# EAGLE design macropad_v1 (EAGLE 9.2.1)
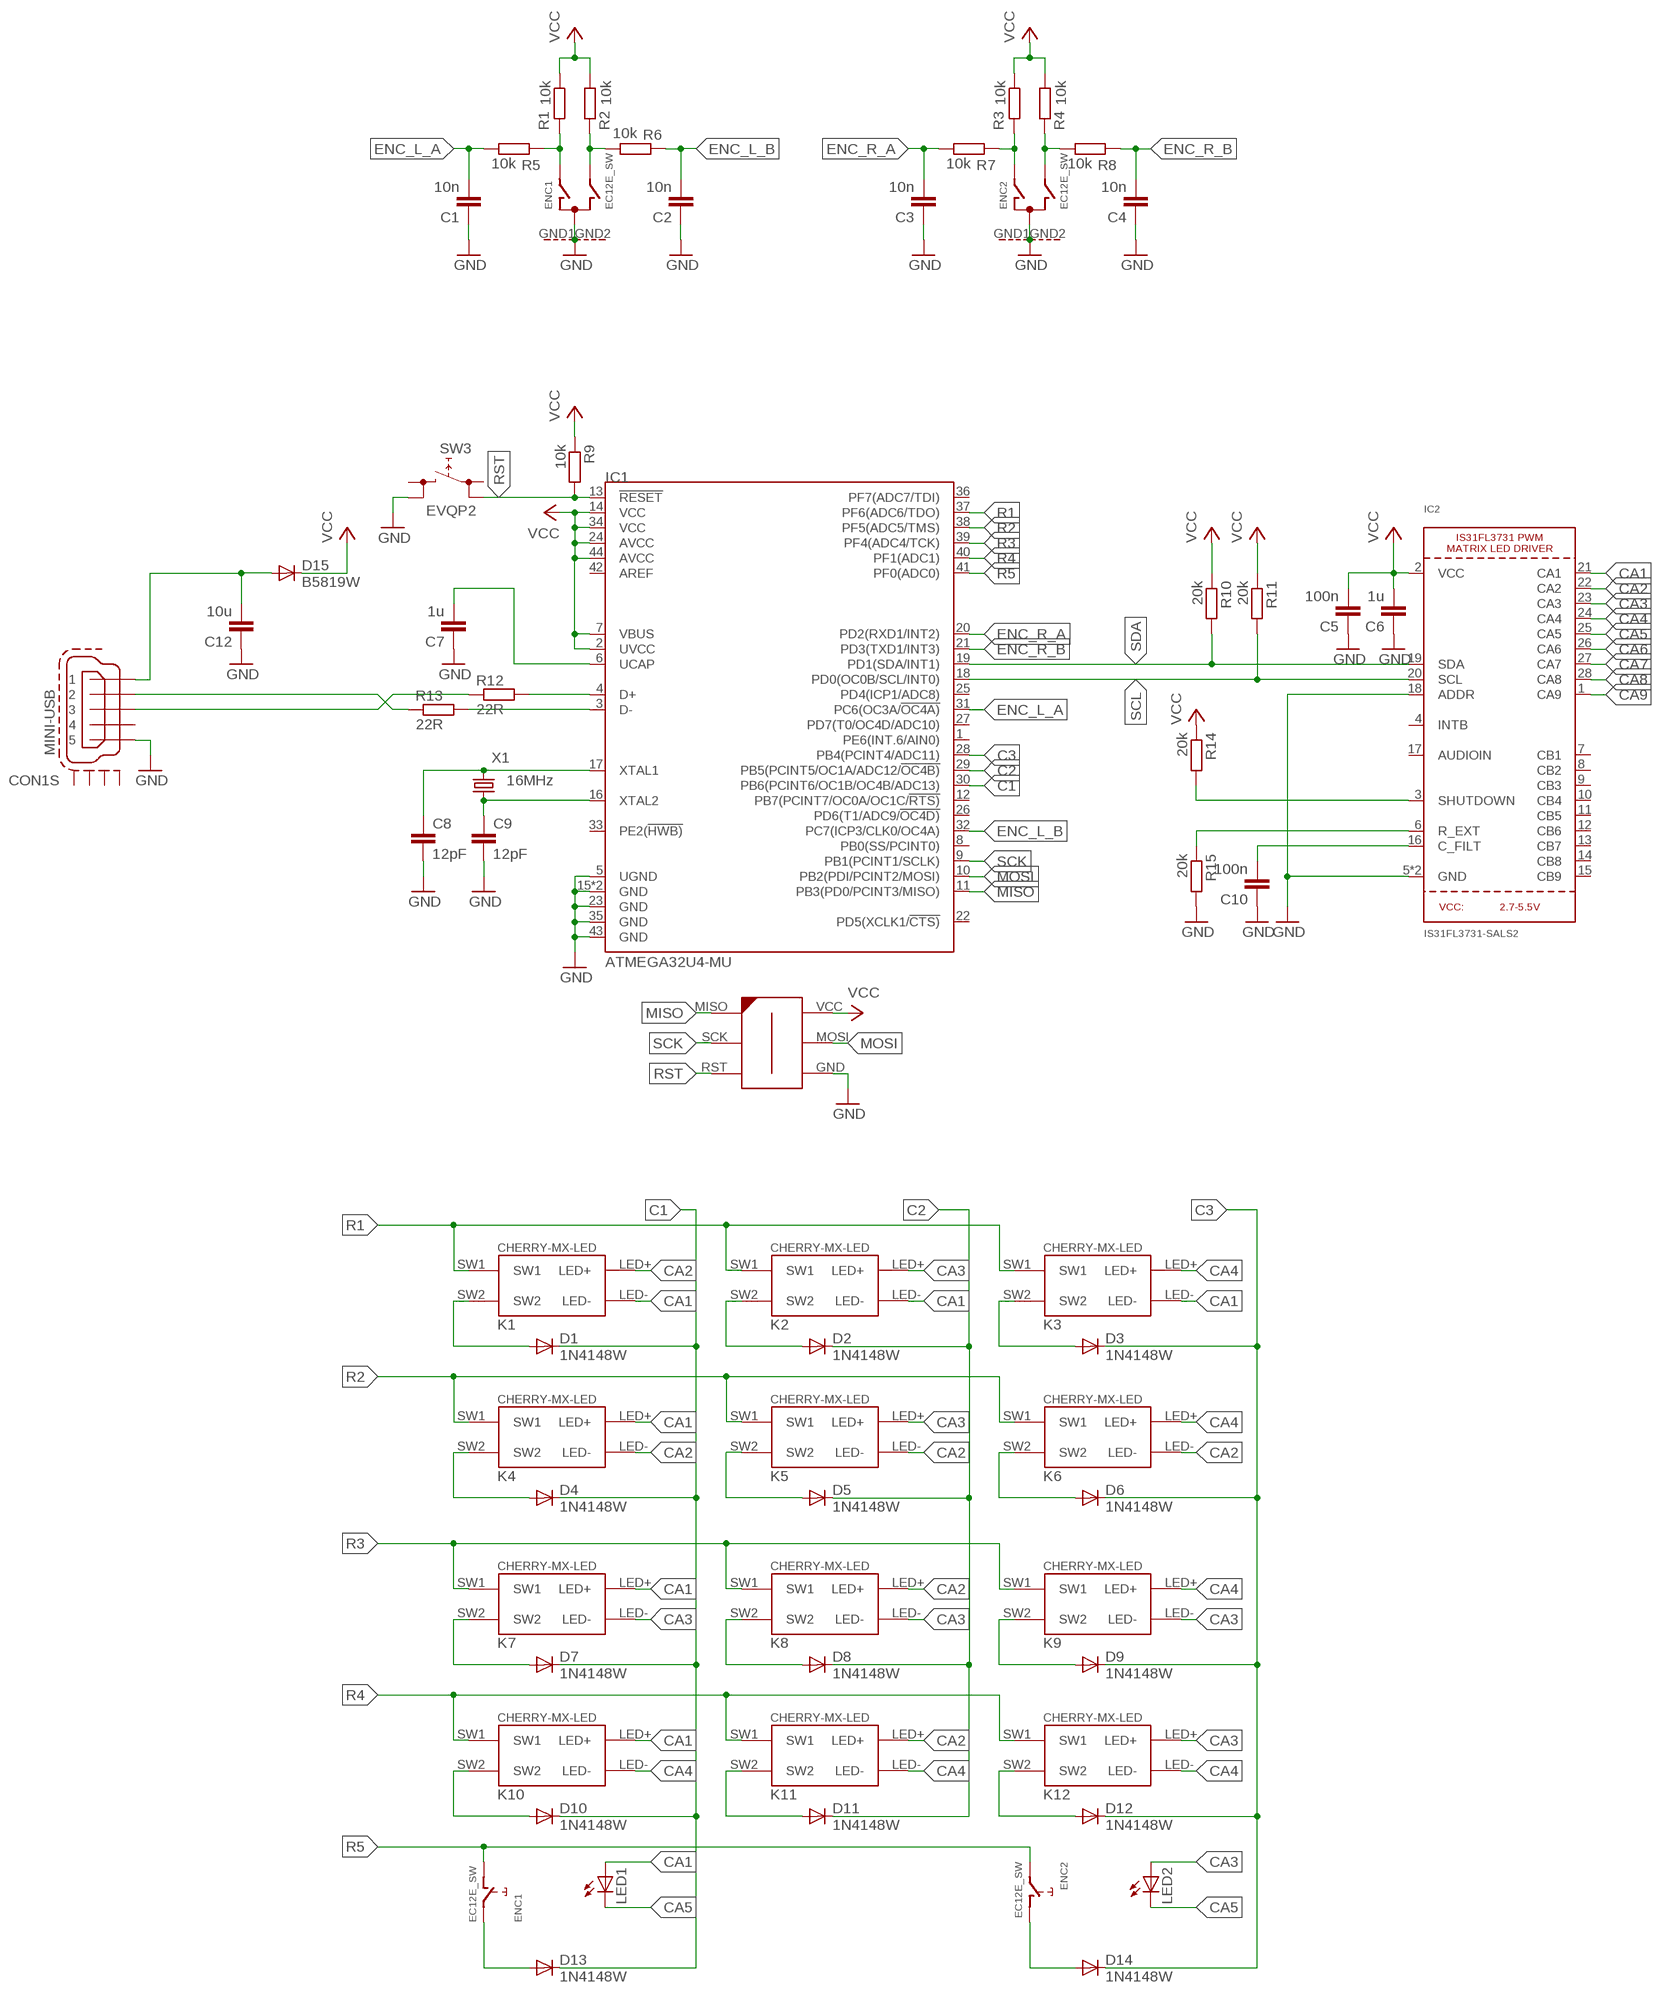
[diagram p0: schematic, sheet 1]

## Parts
C1  10n  C-EUC0603  [C0603]
C2  10n  C-EUC0603  [C0603]
C3  10n  C-EUC0603  [C0603]
C4  10n  C-EUC0603  [C0603]
C5  100n  C-EUC0603  [C0603]
C6  1u  C-EUC0603  [C0603]
C7  1u  C-EUC0603  [C0603]
C8  12pF  C-EUC0603  [C0603]
C9  12pF  C-EUC0603  [C0603]
C10  100n  C-EUC0603  [C0603]
C12  10u  C-EUC0603  [C0603]
CON1  MINI-USB  MINI-USB-SCHIELD-32005-201  [32005-201]
D1  1N4148W  DIODE-SOD123  [SOD123]
D2  1N4148W  DIODE-SOD123  [SOD123]
D3  1N4148W  DIODE-SOD123  [SOD123]
D4  1N4148W  DIODE-SOD123  [SOD123]
D5  1N4148W  DIODE-SOD123  [SOD123]
D6  1N4148W  DIODE-SOD123  [SOD123]
D7  1N4148W  DIODE-SOD123  [SOD123]
D8  1N4148W  DIODE-SOD123  [SOD123]
D9  1N4148W  DIODE-SOD123  [SOD123]
D10  1N4148W  DIODE-SOD123  [SOD123]
D11  1N4148W  DIODE-SOD123  [SOD123]
D12  1N4148W  DIODE-SOD123  [SOD123]
D13  1N4148W  DIODE-SOD123  [SOD123]
D14  1N4148W  DIODE-SOD123  [SOD123]
D15  B5819W  DIODE-SOD123  [SOD123]
ENC1  EC12E_SW  [ALPS_EC12E_SW]
ENC2  EC12E_SW  [ALPS_EC12E_SW]
IC1  ATMEGA32U4-MU  MCU-ATMEGA32U4-MUR(VQFN44)  [QFN44G-0.5-7X7MM]
IC2  IS31FL3731-SALS2  IS31FL3731QFN  [QFN28_4MM_0.4MM]
K1  CHERRY-MX-LED  [CHERRY-MX-LED]
K2  CHERRY-MX-LED  [CHERRY-MX-LED]
K3  CHERRY-MX-LED  [CHERRY-MX-LED]
K4  CHERRY-MX-LED  [CHERRY-MX-LED]
K5  CHERRY-MX-LED  [CHERRY-MX-LED]
K6  CHERRY-MX-LED  [CHERRY-MX-LED]
K7  CHERRY-MX-LED  [CHERRY-MX-LED]
K8  CHERRY-MX-LED  [CHERRY-MX-LED]
K9  CHERRY-MX-LED  [CHERRY-MX-LED]
K10  CHERRY-MX-LED  [CHERRY-MX-LED]
K11  CHERRY-MX-LED  [CHERRY-MX-LED]
K12  CHERRY-MX-LED  [CHERRY-MX-LED]
LED1  LED3MM  [LED3MM]
LED2  LED3MM  [LED3MM]
R1  10k  R-EU_R0603  [R0603]
R2  10k  R-EU_R0603  [R0603]
R3  10k  R-EU_R0603  [R0603]
R4  10k  R-EU_R0603  [R0603]
R5  10k  R-EU_R0603  [R0603]
R6  10k  R-EU_R0603  [R0603]
R7  10k  R-EU_R0603  [R0603]
R8  10k  R-EU_R0603  [R0603]
R9  10k  R-EU_R0603  [R0603]
R10  20k  R-EU_R0603  [R0603]
R11  20k  R-EU_R0603  [R0603]
R12  22R  R-EU_R0603  [R0603]
R13  22R  R-EU_R0603  [R0603]
R14  20k  R-EU_R0603  [R0603]
R15  20k  R-EU_R0603  [R0603]
SW3  EVQP2  [EVQP2]
U$1  AVR-ISP-6-EDGE  [6PAD_ISP]
X1  16MHz  KX-7  [3.2X2.5_KX-7]

## Nets
C1: D1.C D4.C D7.C D10.C D13.C IC1.30(PB6(PCINT6/OC1B/OC4B/ADC13))
C2: D2.C D5.C D8.C D11.C IC1.29(PB5(PCINT5/OC1A/ADC12/!OC4B))
C3: D3.C D6.C D9.C D12.C D14.C IC1.28(PB4(PCINT4/ADC11))
CA1: IC2.21(CA1) K1.LED- K2.LED- K3.LED- K4.LED+ K7.LED+ K10.LED+ LED1.A
CA2: IC2.22(CA2) K1.LED+ K4.LED- K5.LED- K6.LED- K8.LED+ K11.LED+
CA3: IC2.23(CA3) K2.LED+ K5.LED+ K7.LED- K8.LED- K9.LED- K12.LED+ LED2.A
CA4: IC2.24(CA4) K3.LED+ K6.LED+ K9.LED+ K10.LED- K11.LED- K12.LED-
CA5: IC2.25(CA5) LED1.K(C) LED2.K(C)
CA6: IC2.26(CA6)
CA7: IC2.27(CA7)
CA8: IC2.28(CA8)
CA9: IC2.1(CA9)
ENC_L_A: C1.2 IC1.31(PC6(OC3A/!OC4A)) R5.1
ENC_L_B: C2.2 IC1.32(PC7(ICP3/CLK0/OC4A)) R6.2
ENC_R_A: C3.2 IC1.20(PD2(RXD1/INT2)) R7.1
ENC_R_B: C4.2 IC1.21(PD3(TXD1/INT3)) R8.2
GND: C1.1 C2.1 C3.1 C4.1 C5.1 C6.1 C7.1 C8.2 C9.2 C10.1 C12.1 CON1.5 ENC1.C ENC1.GND1(G) ENC1.GND2(G) ENC2.C ENC2.GND1(G) ENC2.GND2(G) IC1.5(UGND) IC1.15(GND) IC1.23(GND) IC1.35(GND) IC1.43(GND) IC1.TAB(GND) IC2.5(GND) IC2.18(ADDR) IC2.THERMAL(GND) R15.2 SW3.2 U$1.GND
MISO: IC1.11(PB3(PD0/PCINT3/MISO)) U$1.MISO
MOSI: IC1.10(PB2(PDI/PCINT2/MOSI)) U$1.MOSI
N$1: D1.A K1.SW2
N$2: D4.A K4.SW2
N$3: D7.A K7.SW2
N$4: D10.A K10.SW2
N$5: D5.A K5.SW2
N$6: D2.A K2.SW2
N$7: D8.A K8.SW2
N$8: D11.A K11.SW2
N$9: D12.A K12.SW2
N$10: D9.A K9.SW2
N$11: D6.A K6.SW2
N$12: D3.A K3.SW2
N$13: IC1.4(D+) R12.2
N$14: IC1.3(D-) R13.2
N$15: CON1.2 R13.1
N$16: CON1.3 R12.1
N$17: C8.1 IC1.17(XTAL1) X1.3
N$18: C12.2 CON1.1 D15.A
N$19: C9.1 IC1.16(XTAL2) X1.1
N$20: C7.2 IC1.6(UCAP)
N$21: IC2.6(R_EXT) R15.1
N$22: D13.A ENC1.E
N$23: D14.A ENC2.D
N$24: C10.2 IC2.16(C_FILT)
N$25: IC2.3(SHUTDOWN) R14.2
N$26: ENC1.A R1.2 R5.2
N$28: ENC2.A R3.2 R7.2
N$31: ENC1.B R2.2 R6.1
N$33: ENC2.B R4.2 R8.1
R1: IC1.37(PF6(ADC6/TDO)) K1.SW1 K2.SW1 K3.SW1
R2: IC1.38(PF5(ADC5/TMS)) K4.SW1 K5.SW1 K6.SW1
R3: IC1.39(PF4(ADC4/TCK)) K7.SW1 K8.SW1 K9.SW1
R4: IC1.40(PF1(ADC1)) K10.SW1 K11.SW1 K12.SW1
R5: ENC1.D ENC2.E IC1.41(PF0(ADC0))
RST: IC1.13(!RESET) R9.2 SW3.3 U$1.RST
SCK: IC1.9(PB1(PCINT1/SCLK)) U$1.SCK
SCL: IC1.18(PD0(OC0B/SCL/INT0)) IC2.20(SCL) R11.2
SDA: IC1.19(PD1(SDA/INT1)) IC2.19(SDA) R10.2
VCC: C5.2 C6.2 D15.C IC1.2(UVCC) IC1.7(VBUS) IC1.14(VCC) IC1.24(AVCC) IC1.34(VCC) IC1.44(AVCC) IC2.2(VCC) R1.1 R2.1 R3.1 R4.1 R9.1 R10.1 R11.1 R14.1 U$1.VCC
Unconnected: CON1.4 CON1.M1(S:S1) CON1.M2(S:S2) CON1.M3(S:S3) CON1.M4(S:S4) IC1.1(PE6(INT.6/AIN0)) IC1.8(PB0(SS/PCINT0)) IC1.12(PB7(PCINT7/OC0A/OC1C/!RTS)) IC1.22(PD5(XCLK1/!CTS)) IC1.25(PD4(ICP1/ADC8)) IC1.26(PD6(T1/ADC9/!OC4D)) IC1.27(PD7(T0/OC4D/ADC10)) IC1.33(PE2(!HWB)) IC1.36(PF7(ADC7/TDI)) IC1.42(AREF) IC2.4(INTB) IC2.7(CB1) IC2.8(CB2) IC2.9(CB3) IC2.10(CB4) IC2.11(CB5) IC2.12(CB6) IC2.13(CB7) IC2.14(CB8) IC2.15(CB9) IC2.17(AUDIOIN) SW3.1 SW3.4

## Library data of the parts
C1-C4 = rcl:C-EU: CAPACITOR, European symbol; LCSC: C57112; SPICEPREFIX: C
C5 C10 = rcl:C-EU: CAPACITOR, European symbol; LCSC: C14663; SPICEPREFIX: C
C6 C7 = rcl:C-EU: CAPACITOR, European symbol; LCSC: C15849; SPICEPREFIX: C
C8 C9 = rcl:C-EU: CAPACITOR, European symbol; LCSC: C38523; SPICEPREFIX: C
C12 = rcl:C-EU: CAPACITOR, European symbol; LCSC: C19702; SPICEPREFIX: C
CON1 = con-cypressindustries:MINI-USB-SCHIELD-: MINI USB-B Conector Source: www.cypressindustries.com; OC_FARNELL: unknown; OC_NEWARK: unknown
D1-D14 = diode:DIODE-: DIODE; LCSC: C81598
D15 = diode:DIODE-: DIODE; LCSC: C8598
ENC1 ENC2 = switch-alps:EC12E_SW: ALPS rotary Encoder EC12E series with switch; MPN: EC12E2424407; OC_FARNELL: 1520813; OC_NEWARK: 74M1068
IC1 = MCU-ATMEGA32U4-MUR_VQFN44_:MCU-ATMEGA32U4-MUR(VQFN44): 310010016; AVAILABILITY: Unavailable; DESCRIPTION: ATmega Series 32 KB Flash 2.5 KB SRAM 16 MHz 8-Bit Microcontroller - MLF/QFN-44; LCSC: C112161; MF: Microchip; MP: ATMEGA32U4-MUR; PACKAGE: VQFN-44 Microchip; PRICE: None
IC2 = microbuilder:IS31FL3731: IS31FL3731 PWM LED Matrix Driver
K1-K12 = cherrymx:CHERRY-MX-LED: Cherry MX series keyswitch with LED
LED1 LED2 = led:LED: LED OSRAM: - CHIPLED LG R971, LG N971, LY N971, LG Q971, LY Q971, LO R971, LY R971 LH N974, LH R974 LS Q976, LO Q976, LY Q976 LO Q996 - Hyper CHIPLED LW Q18S LB Q993, LB Q99A, LB R99A - SideLED LS A670, LO A670, LY A670, LG A670, LP A670 LB A673, LV A673, LT A673, LW A673 LH A674 LY A675 LS A676, LA A676, LO A676, LY A676, LW A676 LS A679, LY A679, LG A679 - Hyper Micro SIDELED® LS Y876, LA Y876, LO Y876, LY Y876 LT Y87S - SmartLED LW L88C, LW L88S LB L89C, LB L89S, LG L890 LS L89K, LO L89K, LY L89K LS L896, LA L896, LO L896, LY L896 - TOPLED LS T670, LO T670, LY T670, LG T670, LP T670 LSG T670, LSP T670, LSY T670, LOP T670, LYG T670 LG T671, LOG T671, LSG T671 LB T673, LV T673, LT T673, LW T673 LH T674 LS T676, LA T676, LO T676, LY T676, LB T676, LH T676, LSB T676, LW T676 LB T67C, LV T67C, LT T67C, LS T67K, LO T67K, LY T67K, LW E67C LS E67B, LA E67B, LO E67B, LY E67B, LB E67C, LV E67C, LT E67C LW T67C LS T679, LY T679, LG T679 LS T770, LO T770, LY T770, LG T770, LP T770 LB T773, LV T773, LT T773, LW T773 LH T774 LS E675, LA E675, LY E675, LS T675 LS T776, LA T776, LO T776, LY T776, LB T776 LHGB T686 LT T68C, LB T68C - Hyper Mini TOPLED® LB M676 - Mini TOPLED Santana® LG M470 LS M47K, LO M47K, LY M47K Source: http://www.osram.convergy.de LUXEON: - LUMILED® LXK2-PW12-R00, LXK2-PW12-S00, LXK2-PW14-U00, LXK2-PW14-V00 LXK2-PM12-R00, LXK2-PM12-S00, LXK2-PM14-U00 LXK2-PE12-Q00, LXK2-PE12-R00, LXK2-PE12-S00, LXK2-PE14-T00, LXK2-PE14-U00 LXK2-PB12-K00, LXK2-PB12-L00, LXK2-PB12-M00, LXK2-PB14-N00, LXK2-PB14-P00, LXK2-PB14-Q00 LXK2-PR12-L00, LXK2-PR12-M00, LXK2-PR14-Q00, LXK2-PR14-R00 LXK2-PD12-Q00, LXK2-PD12-R00, LXK2-PD12-S00 LXK2-PH12-R00, LXK2-PH12-S00 LXK2-PL12-P00, LXK2-PL12-Q00, LXK2-PL12-R00 Source: www.luxeon.com KINGBRIGHT: KA-3528ASYC Source: www.kingbright.com
R1-R9 = rcl:R-EU_: RESISTOR, European symbol; LCSC: C25804; SPICEPREFIX: R
R10 R11 R14 R15 = rcl:R-EU_: RESISTOR, European symbol; LCSC: C4184; SPICEPREFIX: R
R12 R13 = rcl:R-EU_: RESISTOR, European symbol; LCSC: C23345; SPICEPREFIX: R
SW3 = switch:EVQP2; FARNELL: 2079559; MBM: 1; PREIS: 0,738
U$1 = avr-7:AVR-ISP-6-EDGE: 6 pin edge connector for ISP with ATMEL MCUs. Developed by Craig Moates (craig at moates dot net). Library by David Blundell (blundar at gmail dot com). Often, even a 6 pin header is really inconvenient for board layout and/or production. This SMD-only header is our de-facto standard for using an edge connector for programming with the help of a 6pin/10pin to edge card adapter.
X1 = crystal-geyer_V1_0:KX: Quartz Crystals (MHz) SMD: KX - Serie Model Size l/w/h [mm] Frequency Range Frequency Stability Temp. Range [°C] Load Capacitance AECQ 200 availabel Datasheet KX-4 KX-5 KX-6 KX-7 KX-9A KX-9B KX-12A KX-12B KX-13 KX-20 KX-K KX-KS 1.6/1.2/0.3 2.0/1.6/0.45 2.5/2.0/0.55 3.2/2.5/0.8 5.0/3.2/1.0 5.0/3.2/1.1 6.0/3.5/1.1 6.0/3.5/1.0 7.0/5.0 /1.3 11.6/5.5/1.6 12.3/4.5/4.2 12.3/4.5/3.2 24.0 ~ 80.0 MHz 16.0 ~ 80.0 MHz 12.0 ~ 80.0 MHz 8.0 ~ 60.0 MHz 7,68 ~ 300,0 MHz 8,0 ~ 50,0 MHz 8,0 ~ 150,0 MHz 8,0 ~ 50,0 MHz 6,0 ~ 160,0 MHz 3,579 ~ 25,0 MHz 3,579 ~ 70,0 MHz 3,579 ~ 70,0 MHz ±10 … ±50ppm ±10 … ±50ppm ±10 … ±50ppm ±10 … ±50ppm ±10 … ±50ppm ±10 … ±50ppm ±10 … ±50ppm ±10 … ±50ppm ±10 … ±50ppm ±50ppm ±10 … ±50ppm ±10 … ±50ppm (*) -40°C …+85°C (*) -40°C …+125°C (*) -40°C …+125°C (*) -40°C …+125°C (*) -40°C …+105°C (*) -40°C …+105°C (*) -40°C …+125°C (*) -40°C …+105°C (*) -40°C …+105°C (*) -40°C …+105°C (*) -40°C …+85°C (*) -40°C …+85°C 8, 8…16 8, 8…16 10, 8…16 12, 7…20 16, 10…20 16, 10…20 16, 10…20 16, 12…20 16, 12…20 16, 12…20 16, 12…30 16, 12…30 - yes yes yes - - - - - - - - KX-4.pdf <http://www.geyer-electronic.de/uploads/tx_userartikelfrequenz/GEYER-KX-4.pdf> KX-5.pdf <http://www.geyer-electronic.de/uploads/tx_userartikelfrequenz/GEYER-KX-5.pdf> KX-6.pdf <http://www.geyer-electronic.de/uploads/tx_userartikelfrequenz/GEYER-KX-6.pdf> KX-7.pdf <http://www.geyer-electronic.de/uploads/tx_userartikelfrequenz/GEYER-KX-7.pdf> KX-9A.pdf <http://www.geyer-electronic.de/uploads/tx_userartikelfrequenz/GEYER-KX-9A.pdf> KX-9B.pdf <http://www.geyer-electronic.de/uploads/tx_userartikelfrequenz/GEYER-KX-9B.pdf> KX-12A.pdf <http://www.geyer-electronic.de/uploads/tx_userartikelfrequenz/GEYER-KX-12A.pdf> KX-12B.pdf <http://www.geyer-electronic.de/uploads/tx_userartikelfrequenz/GEYER-KX-12B.pdf> KX-13.pdf <http://www.geyer-electronic.de/uploads/tx_userartikelfrequenz/GEYER-KX-13.pdf> KX-20.pdf <http://www.geyer-electronic.de/uploads/tx_userartikelfrequenz/GEYER-KX-20.pdf> KX-K.pdf <http://www.geyer-electronic.de/uploads/tx_userartikelfrequenz/GEYER-KX-K.pdf> KX-KS.pdf <http://www.geyer-electronic.de/uploads/tx_userartikelfrequenz/GEYER-KX-KS.pdf> <http://www.geyer-electronic.de/fileadmin/template/img/logo-geyer-electronic.png> Details see: http://www.geyer-electronic.de/Frequenz-Produkte.9.0.html Created 2016-06-07, Hans Locher 2016 (C) Geyer Quartz Technology KX4,KX5,KX6,KX7,KX9A,KX9B,KX12A,KX12B,KX13,KX20,KXK,KXKS;1612;2016;2520;3225;5032;6035;7050;11655;12345;1,6x1,2;2,0x1,6;2,5x2,0;3,2x2,5;5,0x3,2;6,0x3,5;7,0x5,0;11,6x5,5;12,3x4,5;12,3x4,5;1.6x1.2;2.0x1.6;2.5x2.0;3.2x2.5;5.0x3.2;6.0x3.5;7.0x5.0;11.6x5.5;12.3x4.5;12.3x4.5;; LCSC: C13738

## Board
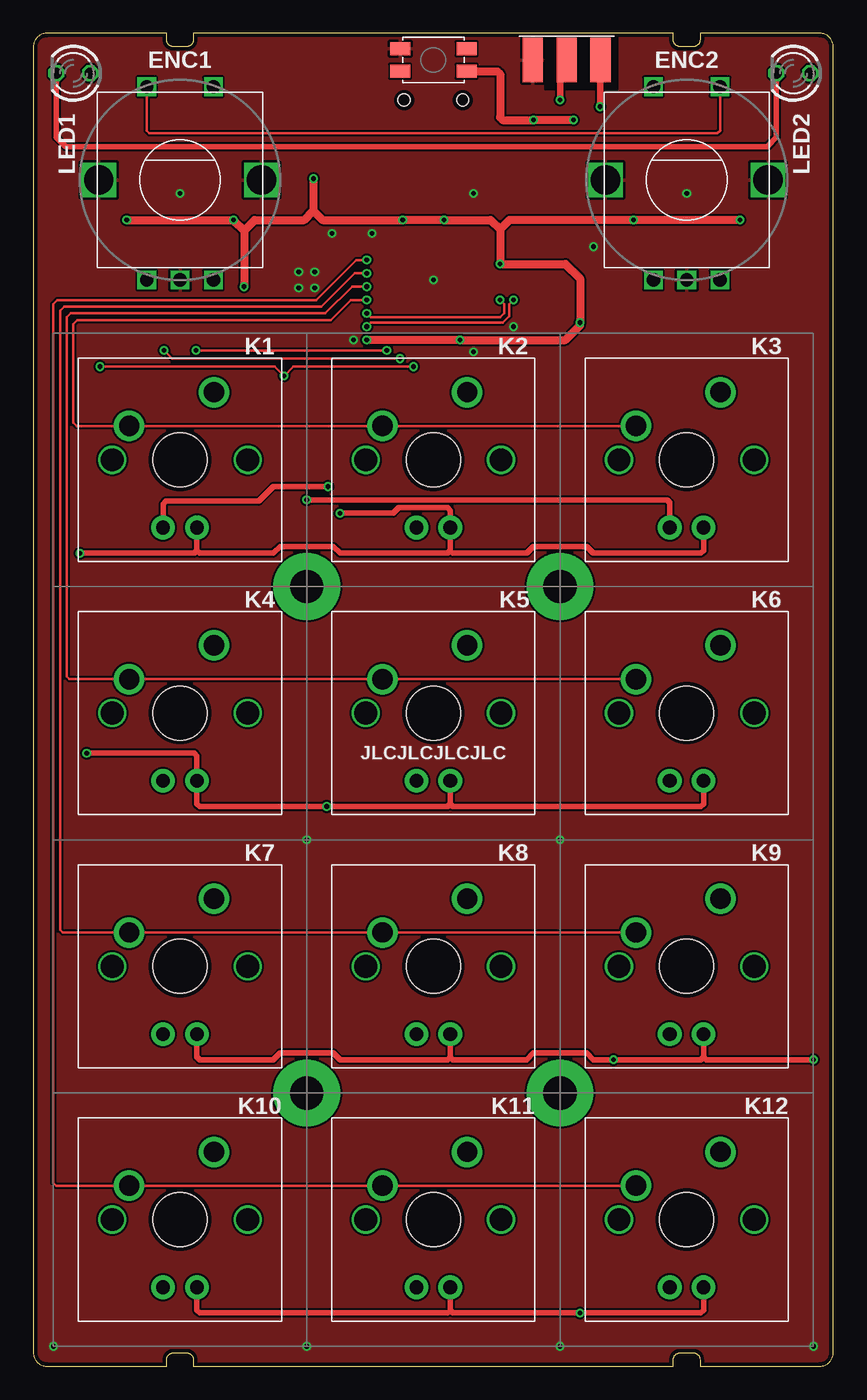
[diagram p1: board, top side]
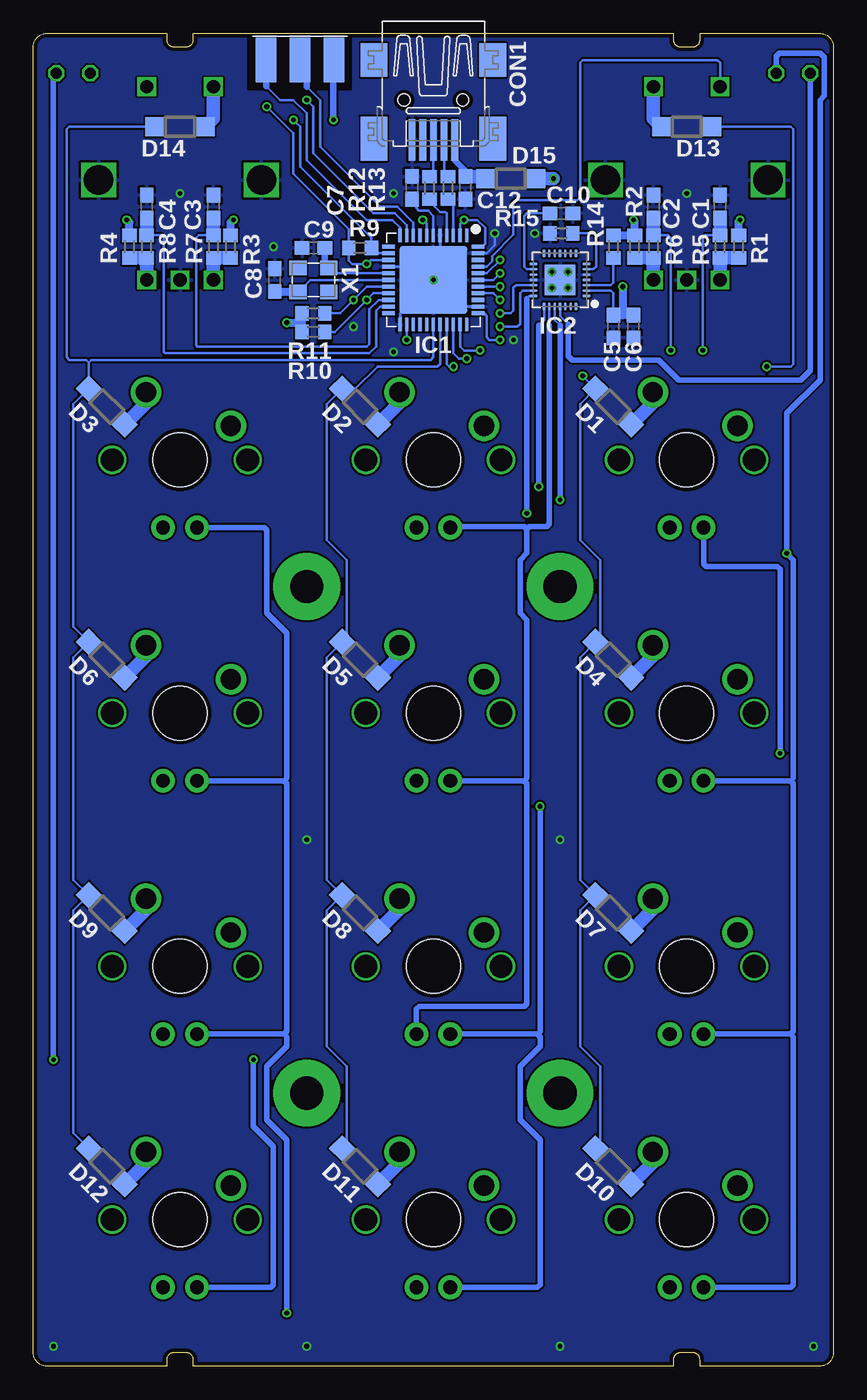
[diagram p2: board, bottom side, seen from below]

Size 60 x 100 mm. Coordinates in mm from the lower left corner, seen from the top.
Outline: 59,100 50,100 50,99.5 arc-90 49.5,99 48.5,99 arc-90 48,99.5 48,100 12,100 12,99.5 arc-90 11.5,99 10.5,99 arc-90 10,99.5 10,100 1,100 arc90 0,99 0,1 arc90 1,0 10,0 10,0.5 arc-90 10.5,1 11.5,1 arc-90 12,0.5 12,0 48,0 48,0.5 arc-90 48.5,1 49.5,1 arc-90 50,0.5 50,0 59,0 arc90 60,1 60,99 arc90 59,100
Copper layers (1*16): Top 0.035mm / dielectric 1.5mm / Bottom 0.035mm
Design rules "PCB-POOL Standard": minimum track width 0.15mm, minimum drill 0.3mm, track to track 0.15mm, track to pad 0.15mm, pad to pad 0.15mm, via to via 0.15mm, smd to smd 0.15mm, copper to edge 0.3mm, drill to drill 0.2mm, minimum pad ring 0.2mm, minimum via ring 0.15mm, stop-mask expansion 0.075mm, vias tented up to drill 0mil, thermal gap 0.2mm
tRestrict: 3 lines
bRestrict: 3 lines

### Footprints (pad centres in the part's own frame; a part is rotated, then mirrored left to right if it is on the bottom)
C0603 = smd 1.1 x 1: 1 -0.85,0; 2 0.85,0
32005-201 = smd 3.1 x 0.5: 1 3,1.6; 2 3,0.8; 3 3,0; 4 3,-0.8; 5 3,-1.6 | smd 2.5 x 2: M1 -3,-4.45; M2 -3,4.45 | smd 3.3 x 2: M3 2.9,4.45; M4 2.9,-4.45 | hole 0.9: 0,2.2; 0,-2.2
SOD123 = smd 1.4 x 1.4: A 1.9,0; C -1.9,0
ALPS_EC12E_SW = drill 1 square: A -2.5,-7.5; B 2.5,-7.5; C 0,-7.5; D -2.5,7; E 2.5,7 | drill 2.2 square: GND1 -6.1,0; GND2 6.1,0
QFN44G-0.5-7X7MM = smd 1 x 0.3: 1 -3.35,2.5; 2 -3.35,2; 3 -3.35,1.5; 4 -3.35,1; 5 -3.35,0.5; 6 -3.35,0; 7 -3.35,-0.5; 8 -3.35,-1; 9 -3.35,-1.5; 10 -3.35,-2; 11 -3.35,-2.5; 23 3.35,-2.5; 24 3.35,-2; 25 3.35,-1.5; 26 3.35,-1; 27 3.35,-0.5; 28 3.35,0; 29 3.35,0.5; 30 3.35,1; 31 3.35,1.5; 32 3.35,2; 33 3.35,2.5 | smd 0.3 x 1: 12 -2.5,-3.35; 13 -2,-3.35; 14 -1.5,-3.35; 15 -1,-3.35; 16 -0.5,-3.35; 17 0,-3.35; 18 0.5,-3.35; 19 1,-3.35; 20 1.5,-3.35; 21 2,-3.35; 22 2.5,-3.35; 34 2.5,3.35; 35 2,3.35; 36 1.5,3.35; 37 1,3.35; 38 0.5,3.35; 39 0,3.35; 40 -0.5,3.35; 41 -1,3.35; 42 -1.5,3.35; 43 -2,3.35; 44 -2.5,3.35 | smd 5.08 x 5.08: TAB 0,0
QFN28_4MM_0.4MM = smd 0.6 x 0.18: 1 -2,1.2; 2 -2,0.8; 3 -2,0.4; 4 -2,0; 5 -2,-0.4; 6 -2,-0.8; 7 -2,-1.2; 15 2,-1.2; 16 2,-0.8; 17 2,-0.4; 18 2,0; 19 2,0.4; 20 2,0.8; 21 2,1.2 | smd 0.18 x 0.6: 8 -1.2,-2; 9 -0.8,-2; 10 -0.4,-2; 11 0,-2; 12 0.4,-2; 13 0.8,-2; 14 1.2,-2; 22 1.2,2; 23 0.8,2; 24 0.4,2; 25 0,2; 26 -0.4,2; 27 -0.8,2; 28 -1.2,2 | smd 2.3 x 2.3: THERMAL 0,0
CHERRY-MX-LED = drill 1.016 pad 1.778: LED+ -1.27,-5.08; LED- 1.27,-5.08 | drill 1.714 pad 1.93: P$3 -5.08,0; P$4 5.08,0 | drill 1.524 pad 2.286: SW1 -3.81,2.54; SW2 2.54,5.08 | hole 4.064: 0,0
LED3MM = drill 0.813 octagon: A -1.27,0; K 1.27,0
R0603 = smd 1 x 1.1: 1 -0.85,0; 2 0.85,0
EVQP2 = smd 1.5 x 1: 1 -2.5,-0.85; 2 -2.5,0.85; 3 2.5,-0.85; 4 2.5,0.85
6PAD_ISP = smd 1.524 x 3.302 bottom: GND 2.54,0; MOSI 0,0; VCC -2.54,0 | smd 1.524 x 3.302: MISO -2.54,0; RST 2.54,0; SCK 0,0
3.2X2.5_KX-7 = smd 1.3 x 1.1: 1 -1.15,-0.9; 2 1.15,-0.9; 3 1.15,0.9; 4 -1.15,0.9

### Placement (x,y rotation side)
C1  8.5,87 270 bottom
C2  13.5,87 270 bottom
C3  46.5,87 270 bottom
C4  51.5,87 270 bottom
C5  16.5,78 90 bottom
C6  15,78 90 bottom
C7  31.6,88.4 270 bottom
C8  41.9,81.5 90 bottom
C9  39,83.9 180 bottom
C10  20.4,86.5 180 bottom
C12  27.6,88.4 90 bottom
CON1  30,95 270 bottom
D1  16.5,72 315 bottom
D2  35.5,72 315 bottom
D3  54.5,72 315 bottom
D4  16.5,53 315 bottom
D5  35.5,53 315 bottom
D6  54.5,53 315 bottom
D7  16.5,34 315 bottom
D8  35.5,34 315 bottom
D9  54.5,34 315 bottom
D10  16.5,15 315 bottom
D11  35.5,15 315 bottom
D12  54.5,15 315 bottom
D13  11,93 180 bottom
D14  49,93 0 bottom
D15  24.2,89.1 180 bottom
ENC1  11,89 0 top
ENC2  49,89 0 top
IC1  30,81.5 270 bottom
IC2  20.5,81.5 180 bottom
K1  11,68 0 top
K2  30,68 0 top
K3  49,68 0 top
K4  11,49 0 top
K5  30,49 0 top
K6  49,49 0 top
K7  11,30 0 top
K8  30,30 0 top
K9  49,30 0 top
K10  11,11 0 top
K11  30,11 0 top
K12  49,11 0 top
LED1  3,97 180 top
LED2  57,97 180 top
R1  7.1,84 270 bottom
R2  14.9,84 270 bottom
R3  45.2,84 270 bottom
R4  52.8,84 270 bottom
R5  8.5,84 270 bottom
R6  13.5,84 90 bottom
R7  46.5,84 270 bottom
R8  51.5,84 90 bottom
R9  35.5,83.9 0 bottom
R10  39,77.6 0 bottom
R11  39,79 0 bottom
R12  30.3,88.4 270 bottom
R13  28.9,88.4 270 bottom
R14  16.5,84 270 bottom
R15  20.4,85 180 bottom
SW3  30,98 0 top
U$1  40,98 0 bottom
X1  39,81.5 180 bottom

### Tracks (layer width: path | path; a pad name or v marks a point on that pad's centre or on a via)
C1  (via drill 0.35)
  Top 0.2: v28.5,75 19.5,75 v18.8,74.3 18.1,75 v5,75
  Bottom 0.2: D1.C 19,72.19 19,62 17.5,60.5 17.5,54.69 D4.C 19,53.19 19,36.5 D7.C 19,34.19 19,24 17.5,22.5 17.5,16.69 D10.C | v28.5,75 28.8,75 29,75.2 IC1.30 | v18.8,74.3 D1.C | D1.C | D13.C 3.2,93 3,92.8 3,75.2 3.2,75 v5,75
C2
  Bottom 0.2: IC1.29 29.5,75.2 29.7,75 34.19,75 35.84,73.34 D2.C 38,72.19 38,62 36.5,60.5 36.5,54.69 D5.C 38,53.19 38,36.5 D8.C 38,34.19 38,24 36.5,22.5 36.5,16.69 D11.C
C3
  Bottom 0.2: D12.C 57,17.5 57,34.19 D9.C 57,36.5 57,53.19 D6.C 57,55.5 57,72.19 D3.C 55.84,75.3 | IC1.28 30,75.7 30.2,75.5 55.64,75.5 55.84,75.3 | D14.C 57.3,93 57.5,92.8 57.5,75.7 57.3,75.5 56.04,75.5 55.84,75.3
CA1  (via drill 0.35)
  Top 0.2: 31.47,61 31.27,61.2
  Top 0.4: K1.LED- 12.27,61.2 | 12.27,61.2 12.47,61 18,61 18.5,61.5 22.5,61.5 23,61 31.07,61 31.27,61.2 K2.LED- 31.27,64.2 31.07,64.4 27.4,64.4 27,64 v23,64 | K3.LED- 50.27,61.2 50.07,61 42,61 41.5,61.5 37.5,61.5 37,61 31.47,61 | v3.5,61 12.07,61 12.27,61.2
  Bottom 0.2: 23,80.1 22.8,80.3 IC2.21 | 3.2,43.92 3,44.12
  Bottom 0.4: K10.LED+ 3.2,5.92 3,6.12 3,24.72 3.2,24.92 | 3.2,24.92 K7.LED+ | 3.2,24.92 3,25.12 3,43.72 3.2,43.92 K4.LED+ | v23,64 23,80.1 | LED1.A 4.27,98.3 4.07,98.5 1,98.5 0.7,98.2 0.7,95.3 1,95 1,74 3.5,71.5 v3.5,61 3,60.5 3,44.12
CA2  (via drill 0.35)
  Top 0.4: 31.27,42.2 31.07,42 v22,42 12.47,42 12.27,42.2 K4.LED- 12.27,45.8 12.07,46 v4,46 | 31.27,42.2 K5.LED- | K6.LED- 50.27,42.2 50.07,42 31.47,42 31.27,42.2 | K1.LED+ 9.73,64.7 9.93,64.9 16.9,64.9 18,66 v22.1,66
  Bottom 0.2: 22.2,24.92 22,25.12 | 22.1,78.1 21.7,78.5 IC2.22
  Bottom 0.4: K11.LED+ 22.2,5.92 22,6.12 22,17 23.5,18.5 23.5,22.5 22,24 22,24.72 22.2,24.92 K8.LED+ | 22,25.12 v22,42 | 22.1,78.1 v22.1,66 | K1.LED+ 9.73,60.2 9.53,60 4.2,60 4,59.8 v4,46
CA3  (via drill 0.35)
  Top 0.4: K7.LED- 12.27,23.2 12.47,23 18,23 18.5,23.5 22.5,23.5 23,23 31.07,23 31.27,23.2 | 31.27,23.2 K8.LED- | K9.LED- 50.27,23.2 | 50.27,23.2 50.07,23 v43.5,23 42,23 41.5,23.5 37.5,23.5 37,23 31.47,23 31.27,23.2 | v58.5,23 50.47,23 50.27,23.2
  Bottom 0.2: 21.3,78.1 IC2.23 | 28.65,63 K2.LED+ | LED2.A 58.3,97
  Bottom 0.4: K5.LED+ 23.2,43.92 | 23.2,43.92 23,44.12 23,56 23.5,56.5 23.5,60.5 23,61 23,62.8 | v43.5,23 43.5,18 42,16.5 42,6.12 42.2,5.92 K12.LED+ | K8.LED- 31.27,26.8 31.07,27 23.2,27 23,27.2 23,43.72 23.2,43.92 | 23,62.8 22.8,63 21.5,63 21.3,63.2 21.3,78.1 | 23,62.8 23.2,63 28.65,63 | 58.3,97 58.5,96.8 v58.5,23
CA4  (via drill 0.35)
  Top 0.2: 31.07,4 31.27,4.2
  Top 0.4: K10.LED- 12.27,4.2 12.47,4 31.07,4 | K11.LED- 31.27,4.2 31.47,4 v41,4 50.07,4 50.27,4.2 K12.LED- | K3.LED+ 47.73,64.8 47.53,65 v20.5,65
  Bottom 0.2: 20.5,78.1 20.9,78.5 IC2.24
  Bottom 0.4: K9.LED+ 41.2,24.92 | 41.2,24.92 41,25.12 41,43.72 41.2,43.92 | 41.2,43.92 K6.LED+ | 41.2,43.92 41,44.12 41,55 42.5,56.5 42.5,62.72 42.7,62.92 K3.LED+ | 41.2,24.92 41,24.72 41,24 42.5,22.5 42.5,18.5 41,17 v41,4 | v20.5,65 20.5,78.1
CA5
  Top 0.4: LED1.K 1.73,92.2 2.43,91.5 55.03,91.5 55.73,92.2 LED2.K
  Bottom 0.2: IC2.25 20.5,78.8 19.9,78.2
  Bottom 0.4: LED1.K 1.73,74.7 2.43,74 11.6,74 13.1,75.5 19.6,75.5 19.9,75.8 19.9,78.2
ENC_L_A  (via drill 0.35)
  Top 0.2: v27.5,75.6 10.4,75.6 v9.8,76.2
  Bottom 0.2: R5.1 9.6,84.85 9.8,84.65 v9.8,76.2 | IC1.31 28.5,76 28.1,75.6 v27.5,75.6
  Bottom 1: R5.1 C1.2
ENC_L_B  (via drill 0.35)
  Top 0.2: v12.2,76.2 v26.5,76.2
  Bottom 0.2: R6.2 12.4,84.85 12.2,84.65 v12.2,76.2 | v26.5,76.2 27.7,76.2 28,76.5 IC1.32
  Bottom 1: R6.2 C2.2
ENC_R_A
  Bottom 0.2: IC1.20 34.1,80 34.8,79.3 34.8,76.7 35,76.5 47.7,76.5 47.8,76.6 47.8,84.65 47.6,84.85 R7.1
  Bottom 1: R7.1 C3.2
ENC_R_B
  Bottom 0.2: R8.2 50.4,84.85 50.2,84.65 50.2,76.1 50.1,76 34.8,76 34.3,76.5 34.3,79.2 34,79.5 IC1.21
  Bottom 1: R8.2 C4.2
GND  (via drill 0.35)
  Bottom 0.2: IC1.5 29.5,81.7 29.7,81.5 IC1.TAB | IC1.TAB 31,82.5 IC1.15 | IC1.43 26,83.5 25.4,84.1 v25.4,85 | IC1.35 28,79.5 IC1.TAB | IC1.23 32.5,79 IC1.TAB
  other vias: 30,81.5 33,88 33,76.1 49,88 11,88 42,84 19.9,82.1 22.4,85 21.1,82.1 19.9,80.9 21.1,80.9 24,77 36,78 20.5,39.5 39.5,39.5 20.5,1.5 39.5,1.5 1.5,1.5 58.5,1.5
  pour Top: 59,100 1,100 arc90 0,99 0,1 arc90 1,0 59,0 arc90 60,1 60,99 arc90
  pour Bottom: 59,100 1,100 arc90 0,99 0,1 arc90 1,0 59,0 arc90 60,1 60,99 arc90
MISO
  Bottom 0.2: IC1.11 32.5,85.4 33.1,86 35,86 39.5,90.5 39.5,94 40.5,95 41.5,95 42.54,96.04
  Bottom 0.5: 42.54,96.04 U$1.MISO
MOSI  (via drill 0.35)
  Top 0.2: 39.5,97.5 U$1.MOSI
  Top 0.5: 39.5,97.5 v39.5,95
  Bottom 0.2: IC1.10 32,85.6 32.9,86.5 34.5,86.5 39,91 39,94.5 v39.5,95
N$1
  Bottom 1: K1.SW2 13.55,72.26 D1.A
N$2
  Bottom 1: K4.SW2 13.54,53.27 D4.A
N$3
  Bottom 1: K7.SW2 13.54,34.27 D7.A
N$4
  Bottom 1: K10.SW2 13.54,15.27 D10.A
N$5
  Bottom 1: K5.SW2 32.54,53.27 D5.A
N$6
  Bottom 1: K2.SW2 32.54,72.27 D2.A
N$7
  Bottom 1: K8.SW2 32.54,34.27 D8.A
N$8
  Bottom 1: K11.SW2 32.54,15.27 D11.A
N$9
  Bottom 1: K12.SW2 51.54,15.27 D12.A
N$10
  Bottom 1: K9.SW2 51.54,34.27 D9.A
N$11
  Bottom 1: K6.SW2 51.54,53.27 D6.A
N$12
  Bottom 1: K3.SW2 51.54,72.27 D3.A
N$13
  Bottom 0.2: IC1.4 29,86.5 29.1,86.6 29.5,86.6 29.9,87 29.9,87.15 R12.2
N$14
  Bottom 0.2: IC1.3 28.5,87.15 R13.2
N$15
  Bottom 0.2: CON1.2 29.2,89.25 R13.1
N$16
  Bottom 0.2: CON1.3 30,89.55 R12.1
N$17
  Bottom 0.2: IC1.17 39.25,81.5 X1.3
  Bottom 0.6: X1.3 41.85,80.6 C8.1
N$18
  Bottom 0.4: C12.2 27.6,89.7 28.4,90.5 CON1.1
  Bottom 1: C12.2 26.25,89.25 D15.A
N$19
  Bottom 0.2: IC1.16 37.45,82 X1.1
  Bottom 0.5: X1.1 38.15,82.7 C9.1
N$20
  Bottom 0.2: IC1.6 30,86.3 30.4,86.7 31.1,86.7 31.3,86.9 31.3,87.25 C7.2
N$21
  Bottom 0.2: IC2.6 18,82.3 17.8,82.5 17.8,84.8 18,85 R15.1
N$22
  Bottom 1: D13.A 13.5,93.6 ENC1.E
N$23
  Bottom 1: ENC2.D 46.5,93.6 D14.A
N$24
  Bottom 0.2: IC2.16 23,82.3 23.2,82.5 23.2,86.3 23,86.5 C10.2
N$25
  Bottom 0.2: IC2.3 16.7,81.1 16.5,81.3 R14.2
N$26
  Bottom 1: R1.2 R5.2 ENC1.A
N$27  (via drill 2.5 pad 5)
  other vias: 20.5,58.5
N$28
  Bottom 1: R3.2 R7.2 ENC2.A
N$29  (via drill 2.5 pad 5)
  other vias: 39.5,58.5
N$30  (via drill 2.5 pad 5)
  other vias: 20.5,20.5
N$31
  Bottom 1: R2.2 R6.1 ENC1.B
N$32  (via drill 2.5 pad 5)
  other vias: 39.5,20.5
N$33
  Bottom 1: R4.2 R8.1 ENC2.B
R1  (via drill 0.35)
  Top 0.2: K3.SW1 K2.SW1 K1.SW1 3.26,70.54 3,70.8 3,78.2 3.3,78.5 22.3,78.5 23.8,80 v25,80
  Bottom 0.2: v25,80 25.5,80.5 IC1.37
R2  (via drill 0.35)
  Top 0.2: K6.SW1 K5.SW1 K4.SW1 2.7,51.54 2.5,51.74 2.5,78.7 2.8,79 21.9,79 23.9,81 v25,81
  Bottom 0.2: v25,81 IC1.38
R3  (via drill 0.35)
  Top 0.2: K9.SW1 K8.SW1 K7.SW1 2.2,32.54 2,32.74 2,79.2 2.3,79.5 21.6,79.5 24.1,82 v25,82
  Bottom 0.2: v25,82 25.5,81.5 IC1.39
R4  (via drill 0.35)
  Top 0.2: K12.SW1 K11.SW1 K10.SW1 1.7,13.54 1.5,13.74 1.5,79.7 1.8,80 21.2,80 24.2,83 v25,83
  Bottom 0.2: v25,83 26,82 IC1.40
R5
  Top 0.2: ENC1.D 8.5,92.7 8.7,92.5 51.3,92.5 51.5,92.7 ENC2.E
  Bottom 0.2: IC1.41 26,82.5 25.6,82.89 25.6,83.3 24,84.9 24,87.3 23.8,87.5 19.2,87.5 19,87.7 19,97.8 18.8,98 8.7,98 8.5,97.8 ENC1.D
RST  (via drill 0.35)
  Top 0.6: v40.5,93.5 v37.5,93.5 35.2,93.5 35,93.7 35,96.95 34.8,97.15 SW3.3
  Bottom 0.2: IC1.13 34.25,83.5 R9.2 34.65,84.65 40,90 40,93 v40.5,93.5 | 37.5,97.96 U$1.RST
  Bottom 0.5: v37.5,93.5 37.5,97.96
SCK
  Bottom 0.2: IC1.9 31.5,85.8 32.7,87 34,87 38.5,91.5 38.5,95 39.5,96
  Bottom 0.5: U$1.SCK 39.5,97.5 39.5,96
SCL  (via drill 0.35)
  Top 0.2: v36,80 35.7,79.7 35.7,78.8 35.2,78.3 25.3,78.3 v25,78
  Bottom 0.2: IC2.20 23.3,80.7 23.5,80.5 23.5,78.2 23.7,78 v25,78 | IC1.18 35,81 v36,80 37,79 R11.2
SDA  (via drill 0.35)
  Top 0.2: v25,79 25.3,78.7 35,78.7 35.3,79 35.3,79.7 v35,80
  Bottom 0.2: IC2.19 23.8,81.1 24,80.9 24,79.2 24.2,79 v25,79 | IC1.19 34.5,80.5 v35,80 37.4,77.6 R10.2
VCC  (via drill 0.35)
  Top 0.2: 42.5,97.96 U$1.VCC
  Top 0.5: v42.5,94.5 42.5,97.96
  Top 0.6: v25,77 v32,77 39.9,77 41,78.1 v41,78.3 41,81.6 39.9,82.7 v35,82.7 35,85.3 | 35,85.3 34.3,86 v30.8,86 v27.7,86 21.7,86 21,86.7 | v7,86 v15,86 15.8,85.2 | v53,86 v45,86 35.7,86 35,85.3 | 15.8,85.2 v15.8,81 | 15.8,85.2 16.6,86 20.3,86 21,86.7 | v21,89.1 21,86.7
  Bottom 0.2: v42.5,94.5 40.5,92.5 40.5,89.45 36.35,85.3 R9.1 36.35,82.95 36.1,82.7 v35,82.7 34.7,83 IC1.14 | IC1.2 28,85.7 v27.7,86 26.7,86 26.1,85.4 26.1,84.2 26.3,84 IC1.44 | IC1.34 26.2,79 26,78.8 26,77.2 25.8,77 v25,77 | IC1.24 v32,77 | IC1.7 30.5,85.7 v30.8,86 | IC2.2 16.7,80.7 16.5,80.5 16.5,78.9 C5.2
  Bottom 0.6: R10.1 39.85,78.3 | 39.85,78.3 R11.1 | C6.2 15.8,78.85 | 15.8,78.85 16.45,78.85 16.5,78.9 | R14.1 R2.1 14.9,85.9 v15,86 | R1.1 7.1,85.9 v7,86 | R3.1 45.2,85.8 v45,86 | R4.1 52.8,85.8 v53,86 | v41,78.3 39.85,78.3 | v15.8,81 15.8,78.85
  Bottom 1: D15.C v21,89.1

### Text on the board
tPlace: JLCJLCJLCJLC
tStop: RST | EL | ER | F1 | F2 | F3 | F4 | F5 | F6 | F7 | F8 | F9 | F10 | F11 | F12 | MacroPad v1
bStop: ISP | 161019kw